# Altium project pinghengche.PrjPcb
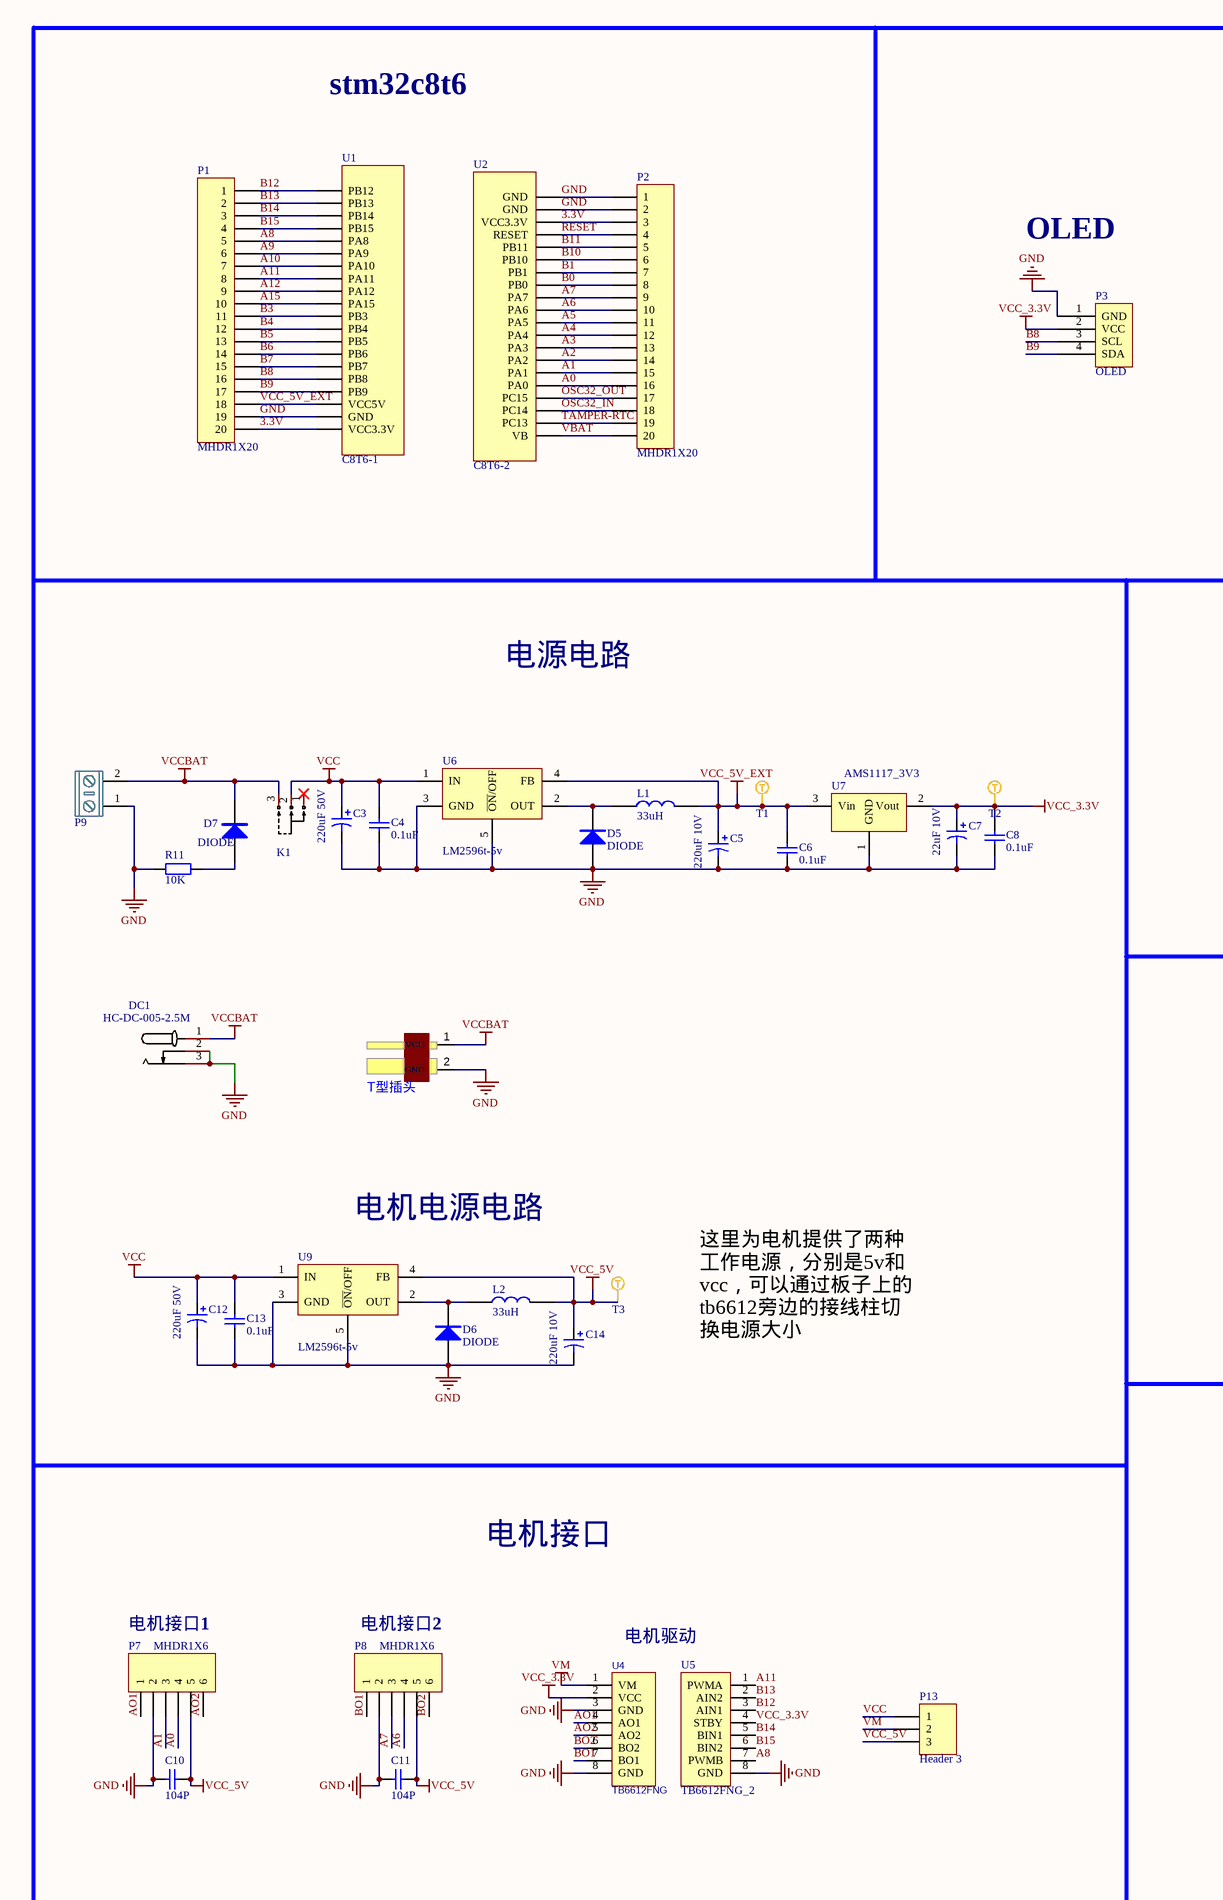
[diagram p0: pinghengche.SchDoc, left]
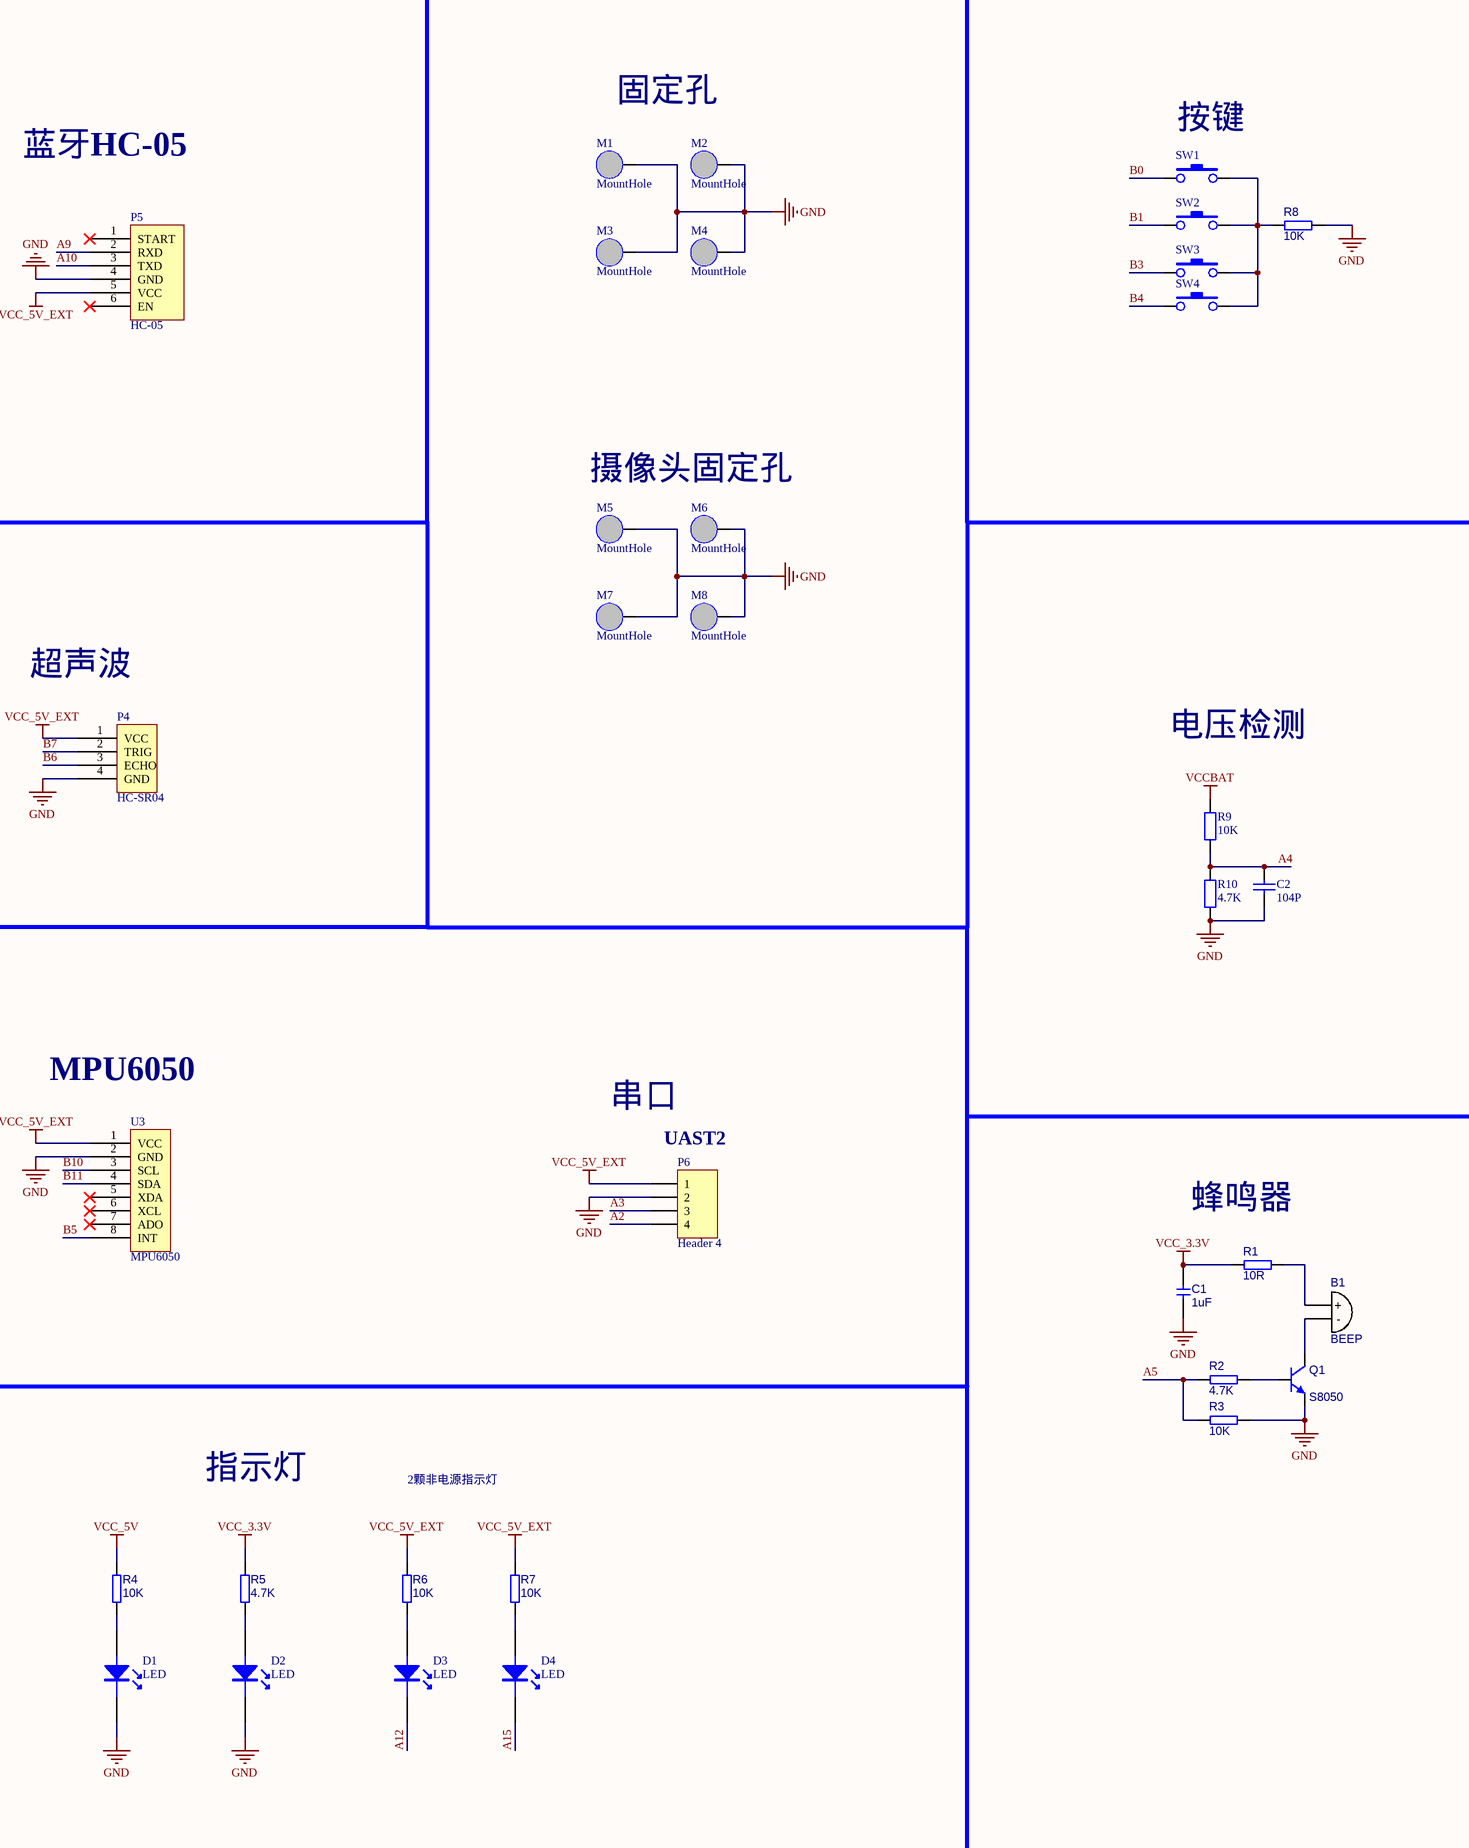
[diagram p1: pinghengche.SchDoc, right]
1 sheet, 71 parts. Net scope: global (net labels, ports and power ports of the same name join across sheets).
Board file: pinghengche.PcbDoc

## Sheet pinghengche.SchDoc
size A2

### Parts
B1  BEEP  [BEEP 9x5.5mm]
C1  value 1uF  [C0805]
C2  104P  [CAPC1608[0603]S-L]
C3  value 220uF 50V  [CAP-SMD_BD10.0-L10.3-W10.3-LS11.3-FD]  (hidden comment: Cap Pol1)
C4  value 0.1uF  [CAPC1608[0603]S-L]  (hidden comment: Cap)
C5  value 220uF 10V  [7343]  (hidden comment: Cap Pol1)
C6  value 0.1uF  [CAPC1608[0603]S-L]  (hidden comment: Cap)
C7  value 22uF 10V  [C3528]  (hidden comment: Cap Pol1)
C8  value 0.1uF  [CAPC1608[0603]S-L]  (hidden comment: Cap)
C10  104P  [CAPC1608[0603]S-L]
C11  104P  [CAPC1608[0603]S-L]
C12  value 220uF 50V  [CAP-SMD_BD10.0-L10.3-W10.3-LS11.3-FD]  (hidden comment: Cap Pol1)
C13  value 0.1uF  [CAPC1608[0603]S-L]  (hidden comment: Cap)
C14  value 220uF 10V  [7343]  (hidden comment: Cap Pol1)
D1  LED  [LED 0805G]
D2  LED  [LED 0805G]
D3  LED  [LED 0805G]
D4  LED  [LED 0805G]
D5  DIODE  [SS34]
D6  DIODE  [SS34]
D7  DIODE  [SS34]
DC1  HC-DC-005-2.5M  [DC-005]
DCIN1  T型插头  [Wired T-Header ThroughHole]
K1  HX SS12D10G4  [SS12D10]  (value not drawn)
L1  33uH  [0630 TPC 7*7*3]
L2  33uH  [0630 TPC 7*7*3]
M1  MountHole  [M3-MountHole]  (no BOM)
M2  MountHole  [M3-MountHole]  (no BOM)
M3  MountHole  [M3-MountHole]  (no BOM)
M4  MountHole  [M3-MountHole]  (no BOM)
M5  MountHole  [M3-MountHole]  (no BOM)
M6  MountHole  [M3-MountHole]  (no BOM)
M7  MountHole  [M3-MountHole]  (no BOM)
M8  MountHole  [M3-MountHole]  (no BOM)
P1  MHDR1X20  [HDR2.54-LI-20P]
P2  MHDR1X20  [HDR2.54-LI-20P]
P3  OLED  [OLED4p]
P4  HC-SR04  [HC-SR04]
P5  HC-05  [HDR-TH_6P-P2.54-V-F]
P6  Header 4  [HDR1X4-M]
P7  MHDR1X6  [XH2.54-WI-6P]
P8  MHDR1X6  [XH2.54-WI-6P]
P9  KF/WJ/DG 30x connecter  [KF/WJ/DG 301-2p-5.0mm]  (value not drawn)
P13  Header 3  [HDR-TH_3P-P2.54-V-M-1]
Q1  S8050  [SOT-23]
R1  value 10R  [R0603]  (hidden comment: 10R ±1%)
R2  value 4.7K  [RESC1608[0603]S-L]  (hidden comment: 4.7K ±1%)
R3  value 10K  [RESC1608[0603]S-L]  (hidden comment: 10K ±1%)
R4  value 10K  [RESC1608[0603]S-L]  (hidden comment: 10K ±1%)
R5  value 4.7K  [RESC1608[0603]S-L]  (hidden comment: 4.7K ±1%)
R6  value 10K  [RESC1608[0603]S-L]  (hidden comment: 10K ±1%)
R7  value 10K  [RESC1608[0603]S-L]  (hidden comment: 10K ±1%)
R8  value 10K  [RESC1608[0603]S-L]  (hidden comment: 10K ±1%)
R9  10K  [RESC1608[0603]S-L]
R10  4.7K  [RESC1608[0603]S-L]
R11  10K  [RESC1608[0603]S-L]
SW1  SW-PB_V  [TSW SMD-3*6*2.5]  (value not drawn)
SW2  SW-PB_V  [TSW SMD-3*6*2.5]  (value not drawn)
SW3  SW-PB_V  [TSW SMD-3*6*2.5]  (value not drawn)
SW4  SW-PB_V  [TSW SMD-3*6*2.5]  (value not drawn)
T1  Testpoint-Pad  [testpoint-pad-1mm]  (value not drawn)  (no BOM)
T2  Testpoint-Pad  [testpoint-pad-1mm]  (value not drawn)  (no BOM)
T3  Testpoint-Pad  [testpoint-pad-1mm]  (value not drawn)  (no BOM)
U1  C8T6-1  [HDR2.54-M-LI-20P]
U2  C8T6-2  [HDR2.54-M-LI-20P]
U3  MPU6050  [HDR2.54-M-LI-8P]
U4  TB6612FNG  [HDR2.54-M-LI-8P]
U5  TB6612FNG_2  [HDR2.54-M-LI-8P]
U6  LM2596t-5v  [LM2596-5V]
U7  AMS1117_3V3  [SOT-223]
U9  LM2596t-5v  [LM2596-5V]

### Nets
GND: C1.1 C2.2 C3.2 C4.2 C5.2 C6.2 C7.2 C8.2 C10.1 C11.1 C12.2 C13.2 C14.2 D1.2 D2.2 D5.1 D6.1 DC1.2 DC1.3 DCIN1.2(GND) M1.1 M2.1 M3.1 M4.1 M5.1 M6.1 M7.1 M8.1 P1.19 P2.1 P2.2 P3.1(GND) P4.4(GND) P5.4(GND) P6.2 P7.2 P8.2 P9.1 Q1.2(E) R3.2 R8.1 R10.1 R11.2 U1.19(GND) U2.1(GND) U2.2(GND) U3.2(GND) U4.3(GND) U4.8(GND) U5.8(GND) U6.3(GND) U6.5(~{ON}/OFF) U7.1(GND) U9.3(GND) U9.5(~{ON}/OFF)
VCC: C3.1 C4.1 C12.1 C13.1 K1.2 P13.1 U6.1(IN) U9.1(IN)
VCC_3.3V: C1.2 C7.1 C8.1 P3.2(VCC) R1.1 R5.2 T2.1(T) U4.2(VCC) U5.4(STBY) U7.2(Vout)
VCC_5V: C10.2 C11.2 C14.1 L2.2 P7.5 P8.5 P13.3 R4.2 T3.1(T) U9.4(FB)
VCC_5V_EXT: C5.1 C6.1 L1.2 P1.18 P4.1(VCC) P5.5(VCC) P6.1 R6.2 R7.2 T1.1(T) U1.18(VCC5V) U3.1(VCC) U6.4(FB) U7.3(Vin)
VCCBAT: D7.2 DC1.1 DCIN1.1(VCC) K1.3 P9.2 R9.2
VM: P13.2 U4.1(VM)
3.3V: P1.20 P2.3 U1.20(VCC3.3V) U2.3(VCC3.3V)
A0: P2.16 P7.4 U2.16(PA0)
A1: P2.15 P7.3 U2.15(PA1)
A2: P2.14 P6.4 U2.14(PA2)
A3: P2.13 P6.3 U2.13(PA3)
A4: C2.1 P2.12 R9.1 R10.2 U2.12(PA4)
A5: P2.11 R2.1 R3.1 U2.11(PA5)
A6: P2.10 P8.4 U2.10(PA6)
A7: P2.9 P8.3 U2.9(PA7)
A8: P1.5 U1.5(PA8) U5.7(PWMB)
A9: P1.6 P5.2(RXD) U1.6(PA9)
A10: P1.7 P5.3(TXD) U1.7(PA10)
A11: P1.8 U1.8(PA11) U5.1(PWMA)
A12: D3.2 P1.9 U1.9(PA12)
A15: D4.2 P1.10 U1.10(PA15)
AO1: P7.1 U4.4(AO1)
AO2: P7.6 U4.5(AO2)
B0: P2.8 SW1.1 U2.8(PB0)
B1: P2.7 SW2.1 U2.7(PB1)
B3: P1.11 SW3.1 U1.11(PB3)
B4: P1.12 SW4.1 U1.12(PB4)
B5: P1.13 U1.13(PB5) U3.8(INT)
B6: P1.14 P4.3(ECHO) U1.14(PB6)
B7: P1.15 P4.2(TRIG) U1.15(PB7)
B8: P1.16 P3.3(SCL) U1.16(PB8)
B9: P1.17 P3.4(SDA) U1.17(PB9)
B10: P2.6 U2.6(PB10) U3.3(SCL)
B11: P2.5 U2.5(PB11) U3.4(SDA)
B12: P1.1 U1.1(PB12) U5.3(AIN1)
B13: P1.2 U1.2(PB13) U5.2(AIN2)
B14: P1.3 U1.3(PB14) U5.5(BIN1)
B15: P1.4 U1.4(PB15) U5.6(BIN2)
BO1: P8.1 U4.7(BO1)
BO2: P8.6 U4.6(BO2)
OSC32_IN: P2.18 U2.18(PC14)
OSC32_OUT: P2.17 U2.17(PC15)
RESET: P2.4 U2.4(RESET)
TAMPER-RTC: P2.19 U2.19(PC13)
VBAT: P2.20 U2.20(VB)
NetB1_1: B1.1(+) R1.2
NetB1_2: B1.2(-) Q1.3(C)
NetD1_1: D1.1 R4.1
NetD2_1: D2.1 R5.1
NetD3_1: D3.1 R6.1
NetD4_1: D4.1 R7.1
NetD5_2: D5.2 L1.1 U6.2(OUT)
NetD6_2: D6.2 L2.1 U9.2(OUT)
NetD7_1: D7.1 R11.1
NetQ1_1: Q1.1(B) R2.2
NetR8_2: R8.2 SW1.2 SW2.2 SW3.2 SW4.2

Not connected (* = marked no-connect by the designer): K1 1*; P5 1(START)* 6(EN)*; U3 5(XDA)* 6(XCL)* 7(ADO)*

### Notes on the sheet
- stm32c8t6
- 固定孔
- (near SW1) 按键
- OLED
- 蓝牙HC-05
- 摄像头固定孔
- 电源电路
- 超声波
- 电压检测
- MPU6050
- 串口
- (near P6) UAST2
- 电机电源电路
- 蜂鸣器
- 这里为电机提供了两种工作电源，分别是5v和vcc，可以通过板子上的tb6612旁边的接线柱切换电源大小
- 指示灯
- 2颗非电源指示灯
- 电机接口
- 电机接口1
- 电机接口2
- (near U4) 电机驱动

### Library data of the parts
B1 = BEEP: 蜂鸣器
C1 = 1uF 080516V X7R: 贴片电容0805; Revision: V1.0
C2 C10 C11 = C: 0.1uf 贴片电容/MLCC电容; BOM名称: 无极性贴片电容; 联系卖家，免费查找封装: 唯一出售店铺网址https://shop463601444.taobao.com
C3 C5 C7 C12 C14 = Cap Pol1: Polarized Capacitor (Radial); Published: 8-Jun-2000; LatestRevisionDate: 17-Jul-2002; LatestRevisionNote: Re-released for DXP Platform.; PackageReference: RB7.6-15; Publisher: Altium Limited
C4 C6 C8 C13 = Cap: Capacitor; Published: 8-Jun-2000; LatestRevisionDate: 17-Jul-2002; LatestRevisionNote: Re-released for DXP Platform.; PackageReference: RAD-0.3; Publisher: Altium Limited
D1-D4 = LED: 0805
DC1 = HC-DC-005-2.5M: Manufacturer: HCTL(华灿天禄); 3DModel: DC-IN-TH_KH-DC-005-2.5; Add into BOM: yes; Name: HC-DC-005-2.5M; Symbol: HC-DC-005-2.5M; Device: HC-DC-005-2.5M; link: https://atta.szlcsc.com/upload/public/pdf/source/20210716/C2847170_7F0110A0BEDEE81C68B76DF87AC8DA16.pdf; Supplier: LCSC; Supplier Part: C3010535; Manufacturer Part: HC-DC-005-2.5M; JLCPCB Part Class: ExtendedPart; Convert to PCB: yes; Origin Footprint: DC-IN-TH_KH-DC-005-2.5
DCIN1 = T_Header
K1 = HX SS12D10G4: 单刀三档开关; Manufacturer: hanxia(韩下); Add into BOM: yes; Name: HX SS12D10G4; Symbol: HX SS12D10G4; Device: HX SS12D10G4; LCSC Part Name: 拨动开关 立式两档拨动,单排3脚插件,12.7x6.7x6.4,黑柄4mm; Supplier Part: C5149841; Manufacturer Part: HX SS12D10G4; Supplier Footprint: 插件; JLCPCB Part Class: Extended Part; Datasheet: https://atta.szlcsc.com/upload/public/pdf/source/20220907/2020D7183ED16DD6E2B9F5A13FB144CF.pdf; Supplier: LCSC; Convert to PCB: yes
L1 L2 = Inductor
M1-M8 = MountHole: 固定孔
P1 P2 = MHDR1X20: Header, 20-Pin; LatestRevisionDate: 17-Jul-2002; LatestRevisionNote: Re-released for DXP Platform.; Publisher: Altium Limited
P3 = 0.96OLED: 0.96寸OLED屏，GND开头
P4 = HC-SR04: 超声波HC-SR04
P5 = HC-05: HC-05 这里只用到了其4个管脚
P6 = Header 4: Header, 4-Pin; LatestRevisionDate: 17-Jul-2002; LatestRevisionNote: Re-released for DXP Platform.; Publisher: Altium Limited
P7 P8 = MHDR1X6: Header, 6-Pin; LatestRevisionDate: 17-Jul-2002; LatestRevisionNote: Re-released for DXP Platform.; Publisher: Altium Limited
P9 = KF/WJ/DG 30x: 接线端子 2Pin
P13 = Header 3: Header, 3-Pin; LatestRevisionDate: 17-Jul-2002; LatestRevisionNote: Re-released for DXP Platform.; Publisher: Altium Limited
Q1 = NPN S8050: Discrete NPN Bipolar Transistor; Published: 8-Jun-2000; Revision: July-2002: Re-released for DXP Platform.; Publisher: Altium Limited; Price(RMB): 0.000; PartNumber: S8050
R1 = Res-Chip_10: 贴片电阻; Published: 8-Jun-2000; Revision: July-2002: Re-released for DXP Platform.; Tolerance: ±1%
R2 R5 = Res-Chip_9: 贴片电阻; Power: 1/8W; Revision: V1.0; Tolerance: ±1%
R3 R4 R6-R8 = Res-Chip: 贴片电阻; Power: 1/8W; Revision: V1.0; Tolerance: ±1%
R9-R11 = R: 贴片电阻; 联系卖家，免费查找封装: 唯一出售店铺网址https://shop463601444.taobao.com; BOM名称: 贴片电阻
SW1-SW4 = SW-PB_V: SWITCH
T1-T3 = Testpoint-Pad-S: 测试点，就是个焊盘
U1 = C8T6-1: stm32f103c8t6扩展接口
U2 = C8T6-2: stm32f103c8t6扩展接口
U3 = MPU6050: MPU6050陀螺仪
U4 = TB6612FNG_1: 电机驱动; 联系卖家 免费查找封装: 唯一出售店铺网址https://shop463601444.taobao.com
U6 U9 = LM2596: Simple Switcher 3A Step Down Voltage Regulator; Note: Tab is connected to GND; Published: 15-Apr-2002; Datasheet: Latest Revision: Jun-1999; Package Reference: TS5B; Publisher: Altium Limited
U7 = AMS1117_1: 3.3V电压转换器AMS1117